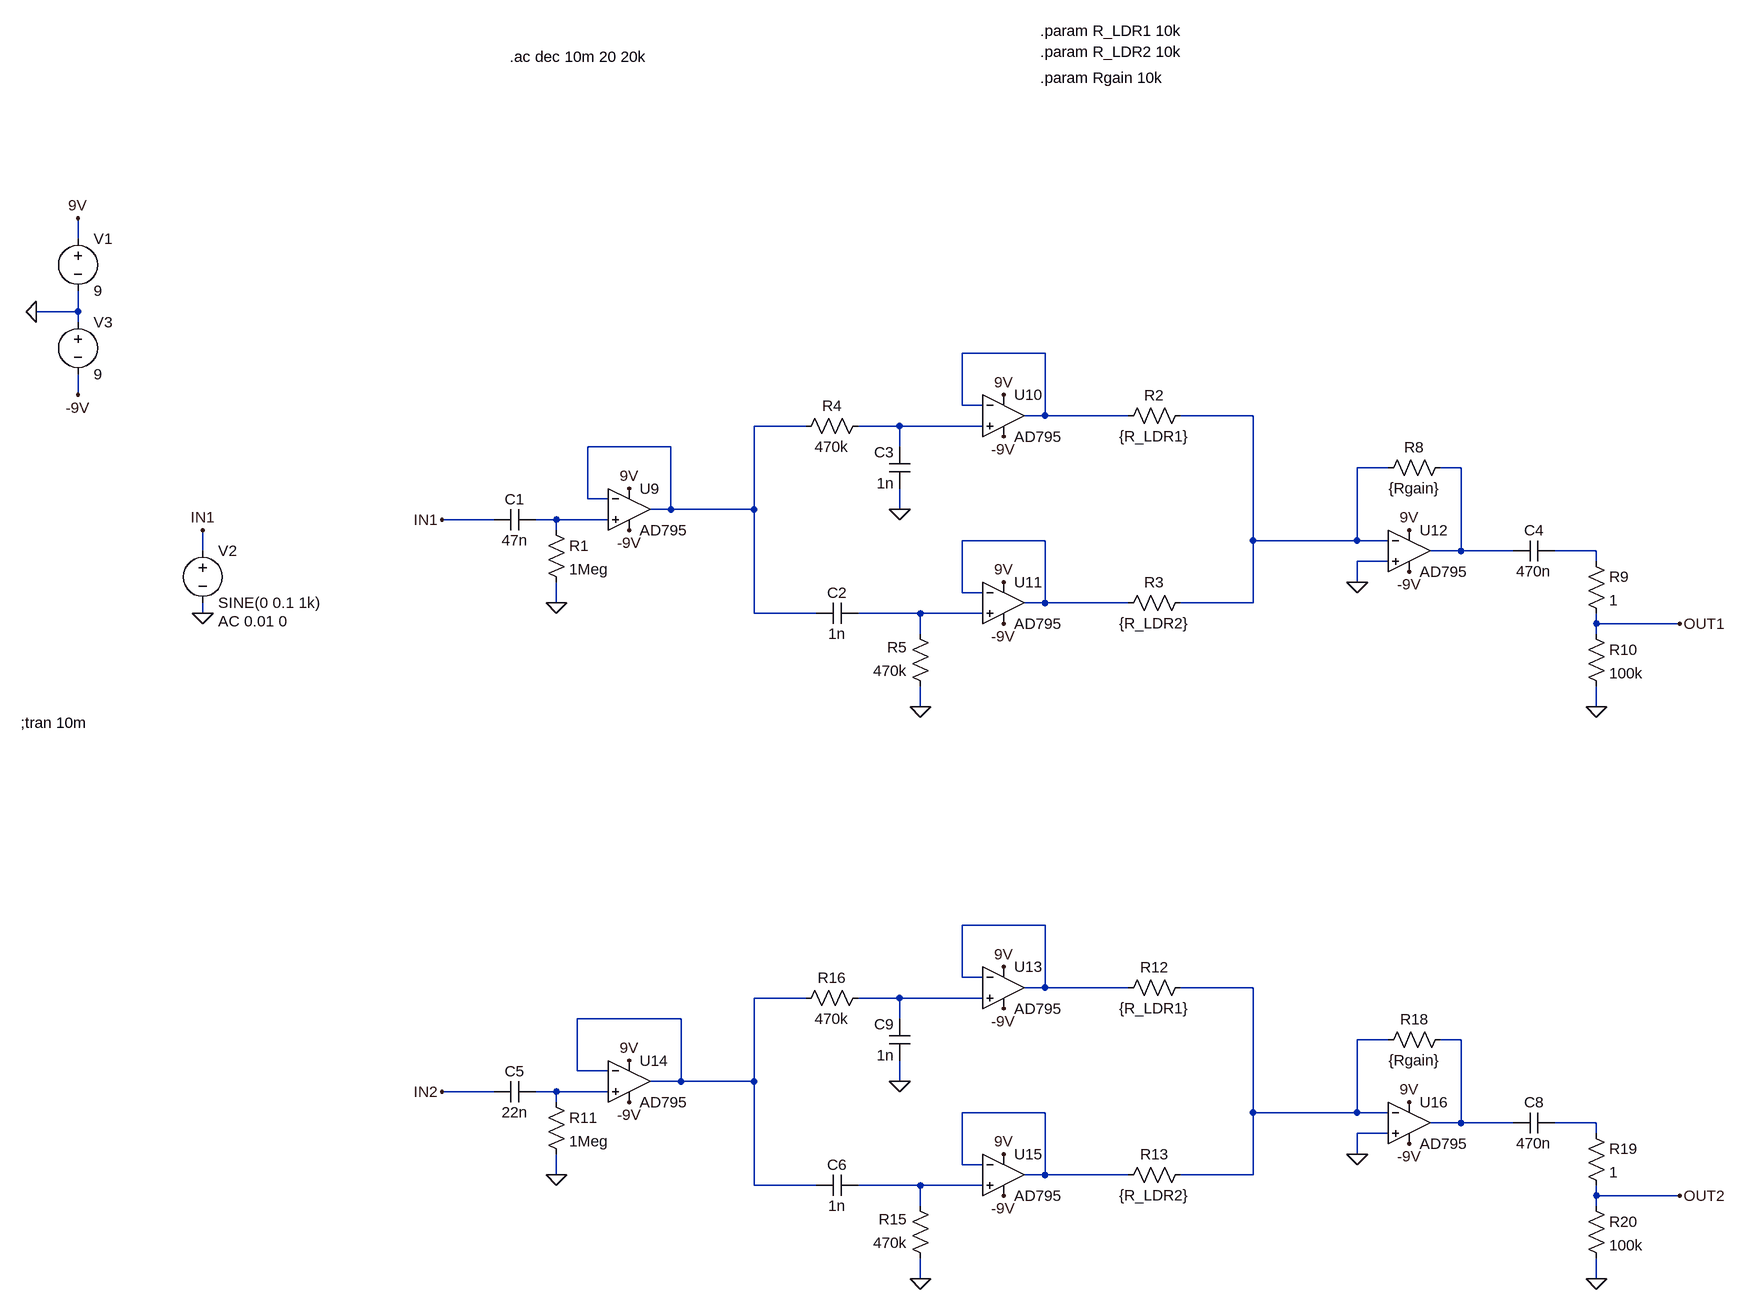
[diagram p0: schematic Tremolo_analog.asc]
Tremolo_analog.asc, the LTspice schematic file:
Version 4
SHEET 1 2368 1320
WIRE -176 -304 -176 -336
WIRE -176 -192 -176 -224
WIRE -176 -192 -240 -192
WIRE -176 -176 -176 -192
WIRE 1312 -128 1184 -128
WIRE -176 -64 -176 -96
WIRE 1184 -48 1184 -128
WIRE 1216 -48 1184 -48
WIRE 1312 -32 1312 -128
WIRE 1312 -32 1280 -32
WIRE 1440 -32 1312 -32
WIRE 1632 -32 1520 -32
WIRE 944 -16 864 -16
WIRE 1088 -16 1024 -16
WIRE 1216 -16 1088 -16
WIRE 736 16 608 16
WIRE 1088 16 1088 -16
WIRE 1840 48 1792 48
WIRE 1952 48 1920 48
WIRE 608 96 608 16
WIRE 640 96 608 96
WIRE 736 112 736 16
WIRE 736 112 704 112
WIRE 864 112 864 -16
WIRE 864 112 736 112
WIRE 1088 112 1088 80
WIRE 464 128 384 128
WIRE 560 128 528 128
WIRE 640 128 560 128
WIRE 560 144 560 128
WIRE 1312 160 1184 160
WIRE 1632 160 1632 -32
WIRE 1792 160 1792 48
WIRE 1792 160 1632 160
WIRE 1840 160 1792 160
WIRE 16 176 16 144
WIRE 1952 176 1952 48
WIRE 1952 176 1904 176
WIRE 2032 176 1952 176
WIRE 2160 176 2096 176
WIRE 1840 192 1792 192
WIRE 2160 192 2160 176
WIRE 1792 224 1792 192
WIRE 1184 240 1184 160
WIRE 1216 240 1184 240
WIRE 560 256 560 224
WIRE 1312 256 1312 160
WIRE 1312 256 1280 256
WIRE 1440 256 1312 256
WIRE 1632 256 1632 160
WIRE 1632 256 1520 256
WIRE 16 272 16 256
WIRE 864 272 864 112
WIRE 960 272 864 272
WIRE 1120 272 1024 272
WIRE 1216 272 1120 272
WIRE 2160 288 2160 272
WIRE 2288 288 2160 288
WIRE 1120 304 1120 272
WIRE 2160 304 2160 288
WIRE 1120 416 1120 384
WIRE 2160 416 2160 384
WIRE 1312 752 1184 752
WIRE 1184 832 1184 752
WIRE 1216 832 1184 832
WIRE 1312 848 1312 752
WIRE 1312 848 1280 848
WIRE 1440 848 1312 848
WIRE 1632 848 1520 848
WIRE 944 864 864 864
WIRE 1088 864 1024 864
WIRE 1216 864 1088 864
WIRE 752 896 592 896
WIRE 1088 896 1088 864
WIRE 1840 928 1792 928
WIRE 1952 928 1920 928
WIRE 592 976 592 896
WIRE 640 976 592 976
WIRE 752 992 752 896
WIRE 752 992 704 992
WIRE 864 992 864 864
WIRE 864 992 752 992
WIRE 1088 992 1088 960
WIRE 464 1008 384 1008
WIRE 560 1008 528 1008
WIRE 640 1008 560 1008
WIRE 560 1024 560 1008
WIRE 1312 1040 1184 1040
WIRE 1632 1040 1632 848
WIRE 1792 1040 1792 928
WIRE 1792 1040 1632 1040
WIRE 1840 1040 1792 1040
WIRE 1952 1056 1952 928
WIRE 1952 1056 1904 1056
WIRE 2032 1056 1952 1056
WIRE 2160 1056 2096 1056
WIRE 1840 1072 1792 1072
WIRE 2160 1072 2160 1056
WIRE 1792 1104 1792 1072
WIRE 1184 1120 1184 1040
WIRE 1216 1120 1184 1120
WIRE 560 1136 560 1104
WIRE 1312 1136 1312 1040
WIRE 1312 1136 1280 1136
WIRE 1440 1136 1312 1136
WIRE 1632 1136 1632 1040
WIRE 1632 1136 1520 1136
WIRE 864 1152 864 992
WIRE 960 1152 864 1152
WIRE 1120 1152 1024 1152
WIRE 1216 1152 1120 1152
WIRE 2160 1168 2160 1152
WIRE 2288 1168 2160 1168
WIRE 1120 1184 1120 1152
WIRE 2160 1184 2160 1168
WIRE 1120 1296 1120 1264
WIRE 2160 1296 2160 1264
FLAG -176 -336 9V
FLAG 384 128 IN1
FLAG 16 272 0
FLAG 16 144 IN1
FLAG 560 256 0
FLAG -240 -192 0
FLAG -176 -64 -9V
FLAG 672 144 -9V
FLAG 672 80 9V
FLAG 1872 208 -9V
FLAG 1872 144 9V
FLAG 1792 224 0
FLAG 2160 416 0
FLAG 2288 288 OUT1
FLAG 384 1008 IN2
FLAG 560 1136 0
FLAG 672 1024 -9V
FLAG 672 960 9V
FLAG 1248 880 -9V
FLAG 1248 816 9V
FLAG 1248 1168 -9V
FLAG 1248 1104 9V
FLAG 1872 1088 -9V
FLAG 1872 1024 9V
FLAG 1792 1104 0
FLAG 2160 1296 0
FLAG 2288 1168 OUT2
FLAG 1120 1296 0
FLAG 1088 992 0
FLAG 1248 0 -9V
FLAG 1248 -64 9V
FLAG 1248 288 -9V
FLAG 1248 224 9V
FLAG 1120 416 0
FLAG 1088 112 0
SYMBOL voltage -176 -320 R0
WINDOW 123 0 0 Left 2
WINDOW 39 0 0 Left 2
SYMATTR InstName V1
SYMATTR Value 9
SYMBOL cap 528 112 R90
WINDOW 0 0 32 VBottom 2
WINDOW 3 32 32 VTop 2
SYMATTR InstName C1
SYMATTR Value 47n
SYMBOL voltage 16 160 R0
WINDOW 123 24 124 Left 2
WINDOW 39 24 152 Left 2
SYMATTR Value2 AC 0.01 0
SYMATTR InstName V2
SYMATTR Value SINE(0 0.1 1k)
SYMBOL res 544 128 R0
SYMATTR InstName R1
SYMATTR Value 1Meg
SYMBOL voltage -176 -192 R0
WINDOW 123 0 0 Left 2
WINDOW 39 0 0 Left 2
SYMATTR InstName V3
SYMATTR Value 9
SYMBOL res 1936 32 R90
WINDOW 0 0 56 VBottom 2
WINDOW 3 32 56 VTop 2
SYMATTR InstName R8
SYMATTR Value {Rgain}
SYMBOL res 2144 176 R0
SYMATTR InstName R9
SYMATTR Value 1
SYMBOL res 2144 288 R0
SYMATTR InstName R10
SYMATTR Value 100k
SYMBOL cap 2096 160 R90
WINDOW 0 0 32 VBottom 2
WINDOW 3 32 32 VTop 2
SYMATTR InstName C4
SYMATTR Value 470n
SYMBOL cap 528 992 R90
WINDOW 0 0 32 VBottom 2
WINDOW 3 32 32 VTop 2
SYMATTR InstName C5
SYMATTR Value 22n
SYMBOL res 544 1008 R0
SYMATTR InstName R11
SYMATTR Value 1Meg
SYMBOL res 1536 832 R90
WINDOW 0 0 56 VBottom 2
WINDOW 3 32 56 VTop 2
SYMATTR InstName R12
SYMATTR Value {R_LDR1}
SYMBOL res 1536 1120 R90
WINDOW 0 0 56 VBottom 2
WINDOW 3 32 56 VTop 2
SYMATTR InstName R13
SYMATTR Value {R_LDR2}
SYMBOL cap 1024 1136 R90
WINDOW 0 0 32 VBottom 2
WINDOW 3 32 32 VTop 2
SYMATTR InstName C6
SYMATTR Value 1n
SYMBOL res 1040 848 R90
WINDOW 0 0 56 VBottom 2
WINDOW 3 32 56 VTop 2
SYMATTR InstName R16
SYMATTR Value 470k
SYMBOL res 1936 912 R90
WINDOW 0 0 56 VBottom 2
WINDOW 3 32 56 VTop 2
SYMATTR InstName R18
SYMATTR Value {Rgain}
SYMBOL res 2144 1056 R0
SYMATTR InstName R19
SYMATTR Value 1
SYMBOL res 2144 1168 R0
SYMATTR InstName R20
SYMATTR Value 100k
SYMBOL cap 2096 1040 R90
WINDOW 0 0 32 VBottom 2
WINDOW 3 32 32 VTop 2
SYMATTR InstName C8
SYMATTR Value 470n
SYMBOL res 1136 1280 R180
WINDOW 0 36 76 Left 2
WINDOW 3 36 40 Left 2
SYMATTR InstName R15
SYMATTR Value 470k
SYMBOL cap 1104 960 R180
WINDOW 0 24 56 Left 2
WINDOW 3 24 8 Left 2
SYMATTR InstName C9
SYMATTR Value 1n
SYMBOL res 1536 -48 R90
WINDOW 0 0 56 VBottom 2
WINDOW 3 32 56 VTop 2
SYMATTR InstName R2
SYMATTR Value {R_LDR1}
SYMBOL res 1536 240 R90
WINDOW 0 0 56 VBottom 2
WINDOW 3 32 56 VTop 2
SYMATTR InstName R3
SYMATTR Value {R_LDR2}
SYMBOL cap 1024 256 R90
WINDOW 0 0 32 VBottom 2
WINDOW 3 32 32 VTop 2
SYMATTR InstName C2
SYMATTR Value 1n
SYMBOL res 1040 -32 R90
WINDOW 0 0 56 VBottom 2
WINDOW 3 32 56 VTop 2
SYMATTR InstName R4
SYMATTR Value 470k
SYMBOL res 1136 400 R180
WINDOW 0 36 76 Left 2
WINDOW 3 36 40 Left 2
SYMATTR InstName R5
SYMATTR Value 470k
SYMBOL cap 1104 80 R180
WINDOW 0 24 56 Left 2
WINDOW 3 24 8 Left 2
SYMATTR InstName C3
SYMATTR Value 1n
SYMBOL Opamps\\AD795 672 48 R0
SYMATTR InstName U9
SYMBOL Opamps\\AD795 1248 -96 R0
SYMATTR InstName U10
SYMBOL Opamps\\AD795 1248 192 R0
SYMATTR InstName U11
SYMBOL Opamps\\AD795 1872 112 R0
SYMATTR InstName U12
SYMBOL Opamps\\AD795 1248 784 R0
SYMATTR InstName U13
SYMBOL Opamps\\AD795 672 928 R0
SYMATTR InstName U14
SYMBOL Opamps\\AD795 1248 1072 R0
SYMATTR InstName U15
SYMBOL Opamps\\AD795 1872 992 R0
SYMATTR InstName U16
TEXT 1304 -624 Left 2 !.param R_LDR1 10k
TEXT 1304 -592 Left 2 !.param R_LDR2 10k
TEXT 1304 -552 Left 2 !.param Rgain 10k
TEXT -264 440 Left 2 !;tran 10m
TEXT 488 -584 Left 2 !.ac dec 10m 20 20k

The netlist it stands for:
* Tremolo_analog.asc
V1 9V 0 9
C1 N006 IN1 47n
V2 IN1 0 SINE(0 0.1 1k) AC 0.01 0
R1 N006 0 1Meg
V3 0 -9V 9
R8 N005 N002 {Rgain}
R9 N008 OUT1 1
R10 OUT1 0 100k
C4 N008 N005 470n
C5 N015 IN2 22n
R11 N015 0 1Meg
R12 N011 N010 {R_LDR1}
R13 N011 N016 {R_LDR2}
C6 N018 N012 1n
R16 N013 N012 470k
R18 N014 N011 {Rgain}
R19 N017 OUT2 1
R20 OUT2 0 100k
C8 N017 N014 470n
R15 0 N018 470k
C9 0 N013 1n
R2 N002 N001 {R_LDR1}
R3 N002 N007 {R_LDR2}
C2 N009 N003 1n
R4 N004 N003 470k
R5 0 N009 470k
C3 0 N004 1n
XU9 N006 N003 9V -9V N003 AD795  ; pins In+ In- V+ V- OUT
XU10 N004 N001 9V -9V N001 AD795  ; pins In+ In- V+ V- OUT
XU11 N009 N007 9V -9V N007 AD795  ; pins In+ In- V+ V- OUT
XU12 0 N002 9V -9V N005 AD795  ; pins In+ In- V+ V- OUT
XU13 N013 N010 9V -9V N010 AD795  ; pins In+ In- V+ V- OUT
XU14 N015 N012 9V -9V N012 AD795  ; pins In+ In- V+ V- OUT
XU15 N018 N016 9V -9V N016 AD795  ; pins In+ In- V+ V- OUT
XU16 0 N011 9V -9V N014 AD795  ; pins In+ In- V+ V- OUT
.param R_LDR1 10k
.param R_LDR2 10k
.param Rgain 10k
;tran 10m
.ac dec 10m 20 20k
.lib ADI1.lib
.backanno
.end